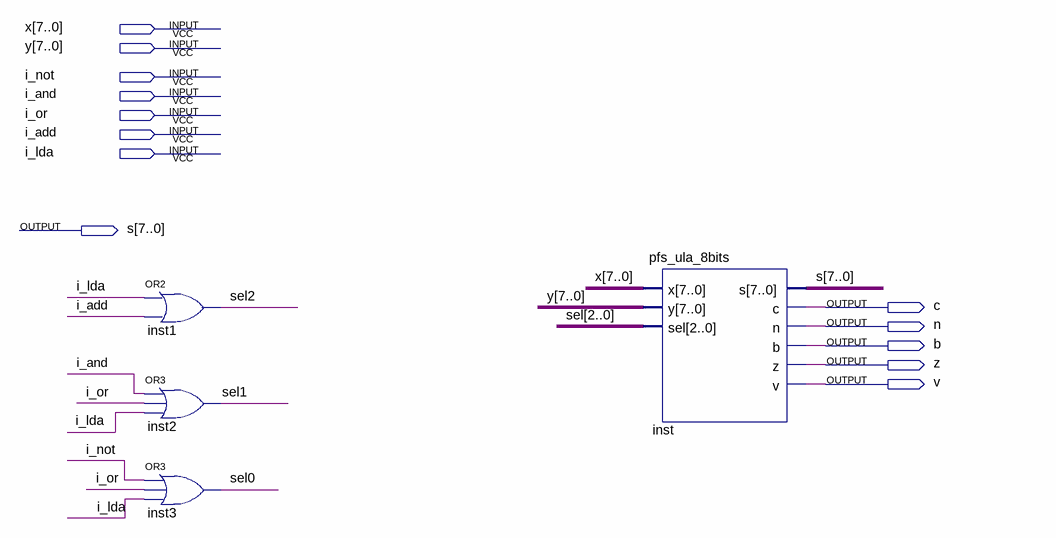
[diagram p0: schematic sheet]
// Quartus schematic pfs_neander_ula.bdf as structural Verilog: 4 symbols, 13 pins
module pfs_neander_ula (
  input  [7:0] x,
  input  [7:0] y,
  input  i_not,
  input  i_and,
  input  i_or,
  input  i_add,
  input  i_lda,
  output [7:0] s,
  output c,
  output n,
  output b,
  output z,
  output v
);

  wire [2:0] sel;

  or inst1 (sel[2], i_lda, i_add);
  or inst2 (sel[1], i_and, i_or, i_lda);
  or inst3 (sel[0], i_not, i_or, i_lda);
  pfs_ula_8bits inst (.x(x), .y(y), .sel(sel), .s(s), .c(c), .n(n), .b(b), .z(z), .v(v));
endmodule
